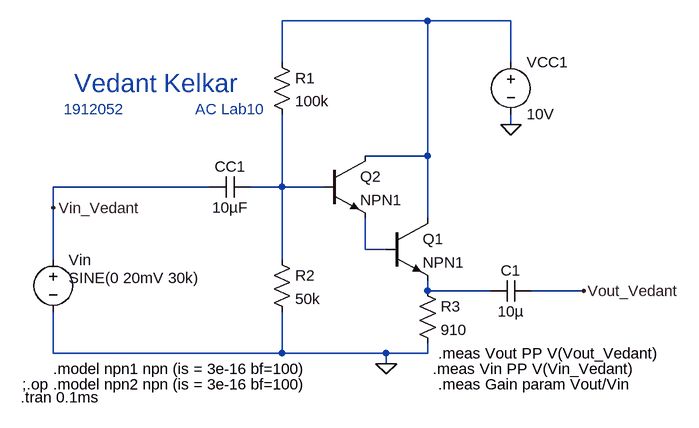
[diagram p0: schematic AC_Lab10.asc]
AC_Lab10.asc, the LTspice schematic file:
Version 4
SHEET 1 880 680
WIRE 272 -96 48 -96
WIRE 400 -96 272 -96
WIRE 48 -32 48 -96
WIRE 400 -32 400 -96
WIRE 400 64 400 48
WIRE 272 112 272 -96
WIRE 272 112 176 112
WIRE -64 160 -304 160
WIRE 48 160 48 48
WIRE 48 160 0 160
WIRE 112 160 48 160
WIRE -304 192 -304 160
WIRE 272 208 272 112
WIRE 176 256 176 208
WIRE 208 256 176 256
WIRE -304 272 -304 192
WIRE 48 272 48 160
WIRE 272 320 272 304
WIRE 368 320 272 320
WIRE 512 320 432 320
WIRE -304 416 -304 352
WIRE 48 416 48 352
WIRE 48 416 -304 416
WIRE 208 416 48 416
WIRE 272 416 272 400
WIRE 272 416 208 416
WIRE 208 432 208 416
FLAG 400 64 0
FLAG 208 432 0
FLAG -304 192 Vin_Vedant
FLAG 512 320 Vout_Vedant
SYMBOL res 32 -48 R0
SYMATTR InstName R1
SYMATTR Value 100k
SYMBOL res 32 256 R0
SYMATTR InstName R2
SYMATTR Value 50k
SYMBOL npn 208 208 R0
SYMATTR InstName Q1
SYMATTR Value NPN1
SYMBOL cap 0 144 R90
WINDOW 0 0 32 VBottom 2
WINDOW 3 32 32 VTop 2
SYMATTR InstName CC1
SYMATTR Value 10µF
SYMBOL voltage -304 256 R0
WINDOW 123 24 124 Left 2
WINDOW 39 0 0 Left 0
WINDOW 3 24 44 Left 2
SYMATTR InstName Vin
SYMATTR Value SINE(0 20mV 30k)
SYMBOL voltage 400 -48 R0
SYMATTR InstName VCC1
SYMATTR Value 10V
SYMBOL npn 112 112 R0
SYMATTR InstName Q2
SYMATTR Value NPN1
SYMBOL res 256 304 R0
SYMATTR InstName R3
SYMATTR Value 910
SYMBOL cap 432 304 R90
WINDOW 0 0 32 VBottom 2
WINDOW 3 32 32 VTop 2
SYMATTR InstName C1
SYMATTR Value 10µ
TEXT -272 0 Left 4 ;Vedant Kelkar
TEXT -288 40 Left 2 ;1912052                AC Lab10
TEXT -304 440 Left 2 !.model npn1 npn (is = 3e-16 bf=100)
TEXT -352 464 Left 2 !;.op
TEXT -304 464 Left 2 !.model npn2 npn (is = 3e-16 bf=100)
TEXT -354 484 Left 2 !.tran 0.1ms
TEXT 288 416 Left 2 !.meas Vout PP V(Vout_Vedant)
TEXT 280 440 Left 2 !.meas Vin PP V(Vin_Vedant)
TEXT 288 464 Left 2 !.meas Gain param Vout/Vin

The netlist it stands for:
* AC_Lab10.asc
R1 N001 N002 100k
R2 N002 0 50k
Q1 N001 N003 N004 0 NPN1
CC1 N002 Vin_Vedant 10µF
Vin Vin_Vedant 0 SINE(0 20mV 30k)
VCC1 N001 0 10V
Q2 N001 N002 N003 0 NPN1
R3 N004 0 910
C1 Vout_Vedant N004 10µ
.model NPN NPN
.model PNP PNP
.lib standard.bjt
* Vedant Kelkar
* 1912052                AC Lab10
.model npn1 npn (is = 3e-16 bf=100)
;.op
.model npn2 npn (is = 3e-16 bf=100)
.tran 0.1ms
.meas Vout PP V(Vout_Vedant)
.meas Vin PP V(Vin_Vedant)
.meas Gain param Vout/Vin
.backanno
.end